# Altium schematic sheet 05 CPU_PWR.SchDoc
size 420 x 297 mm; Address1: Address1; Address2: Address2; Address3: Address3; Address4: Address4; DocumentNumber: АБВГ.123456.001 Э3; SheetNumber: 5; SheetTotal: 23; Scale: 1:1; DocumentType: Схема электрическая принципиальная; FirstReferrence: АБВГ.123456.001
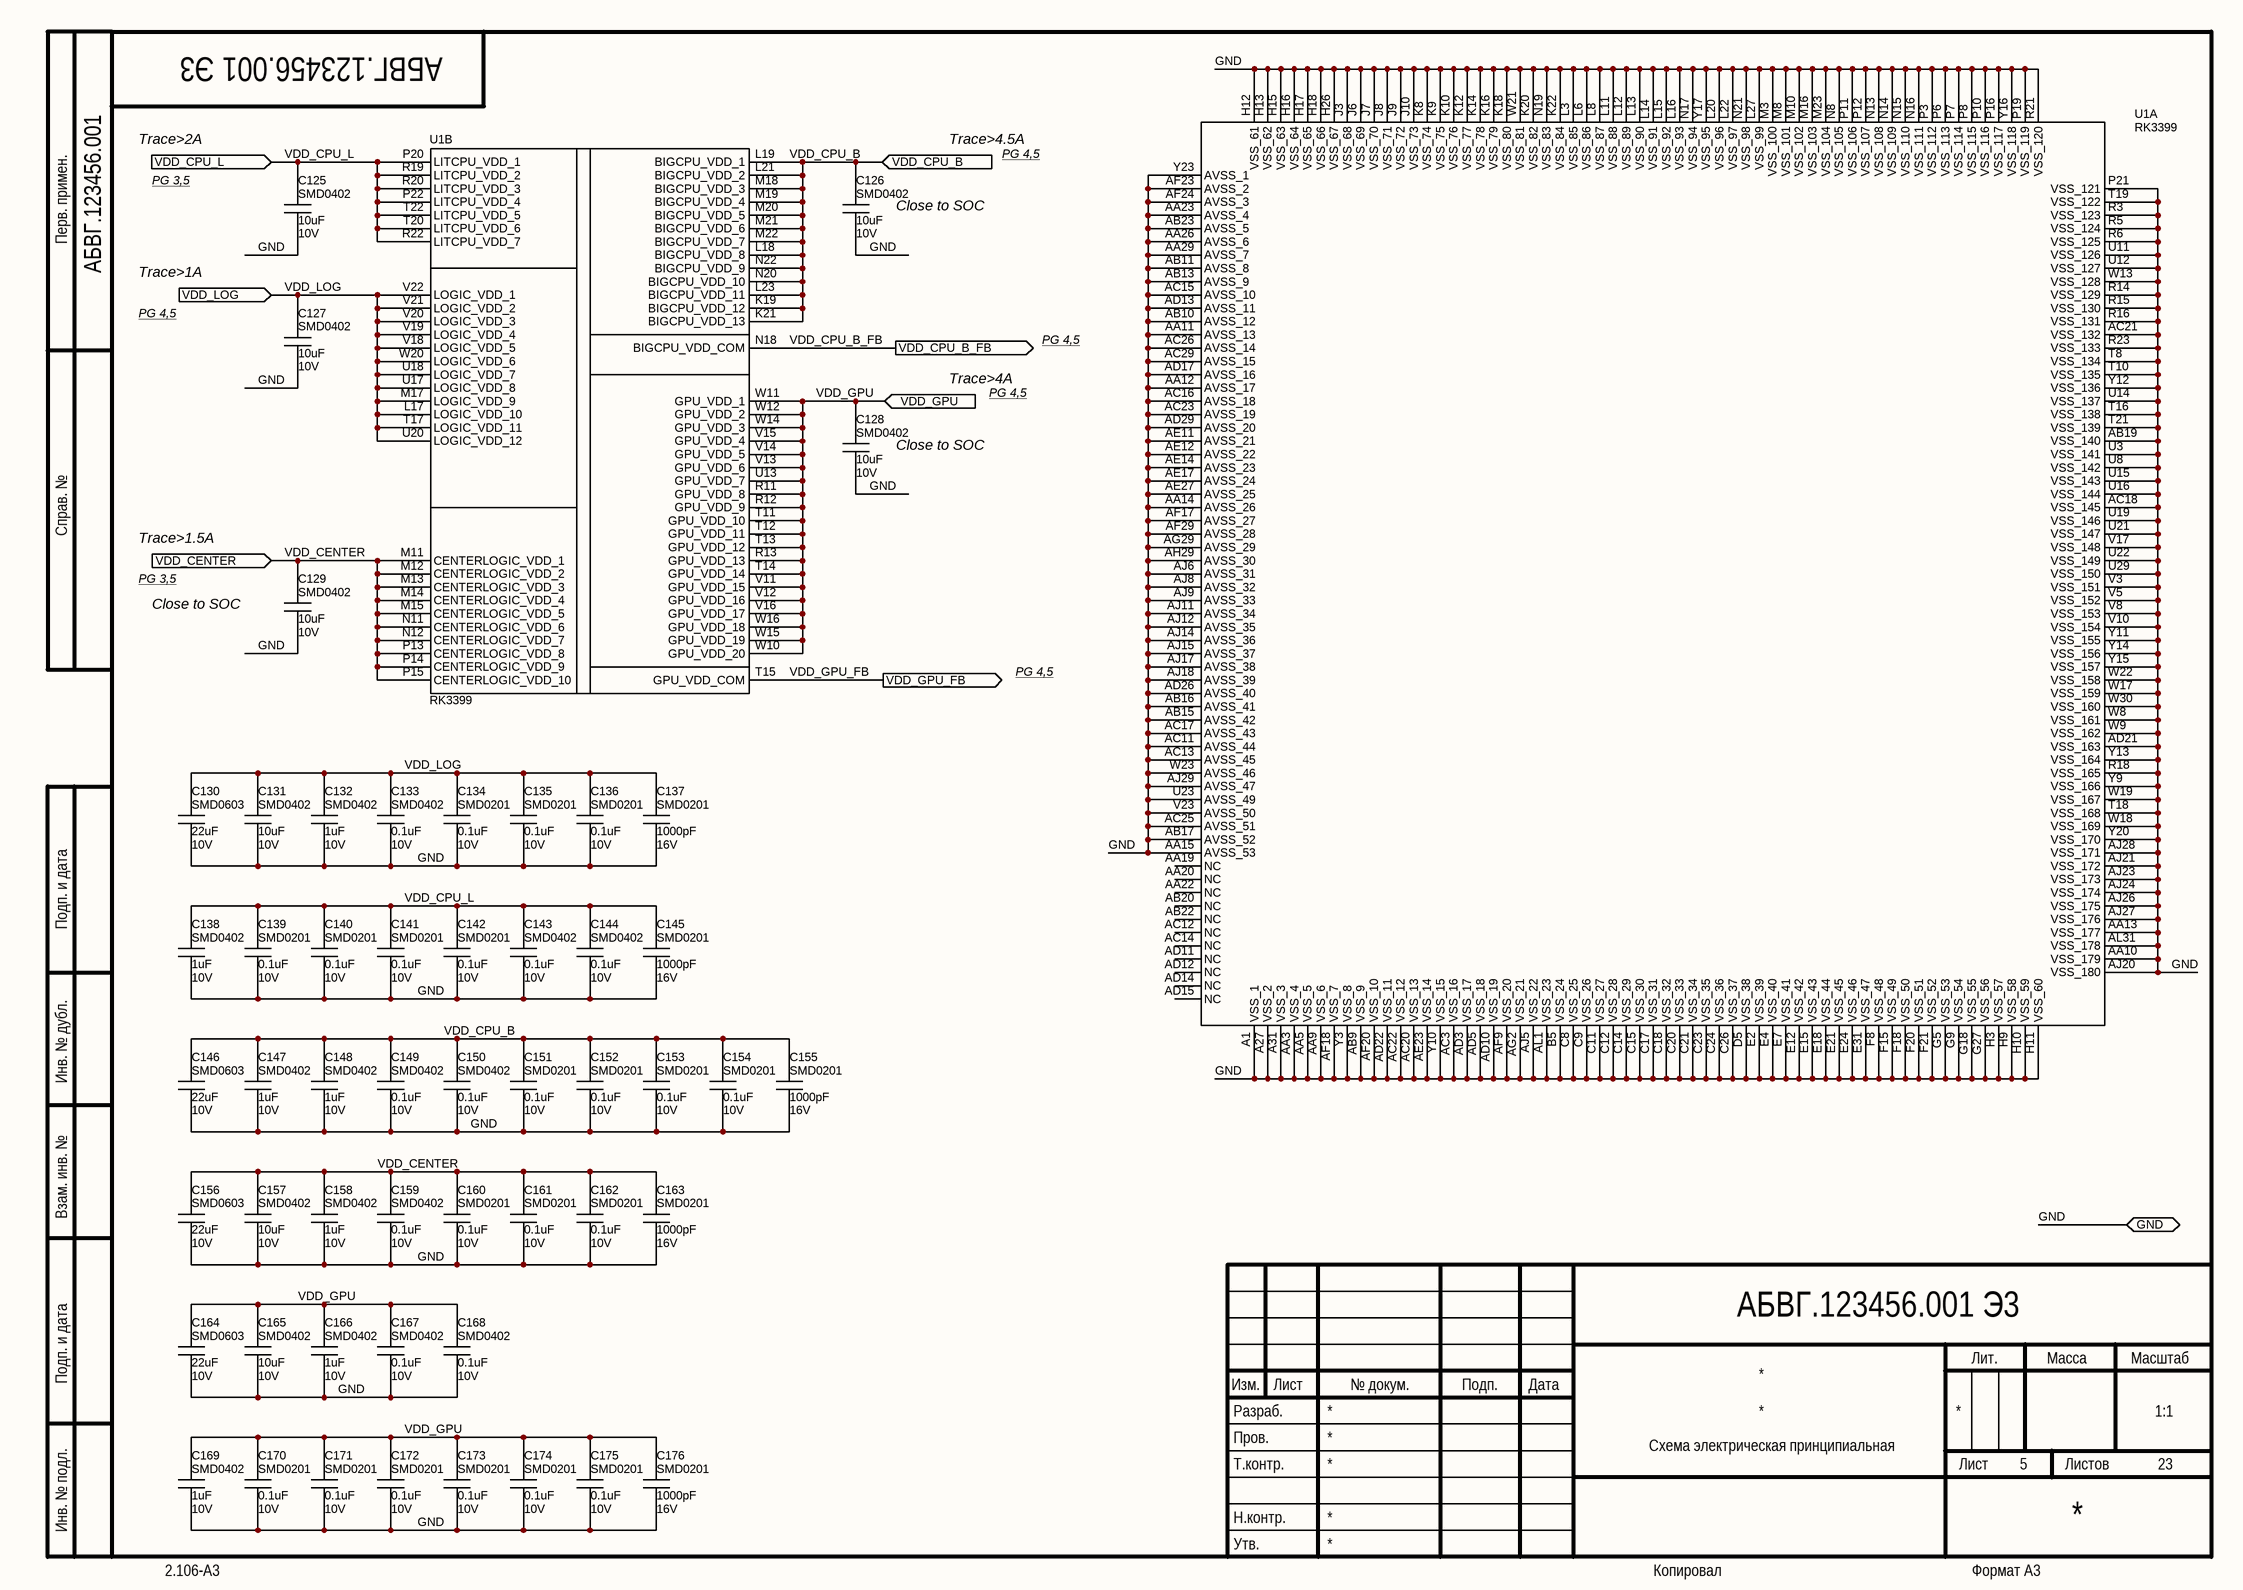
[diagram p0: 05 CPU_PWR.SchDoc]

## Parts
C125  Package: SMD0402  Voltage: 10V  [CAP_SMD_0402_small]  (hidden comment: 10uF)
C126  Package: SMD0402  Voltage: 10V  [CAP_SMD_0402]  (hidden comment: 10uF)
C127  Package: SMD0402  Voltage: 10V  [CAP_SMD_0402_small]  (hidden comment: 10uF)
C128  Package: SMD0402  Voltage: 10V  [CAP_SMD_0402_small]  (hidden comment: 10uF)
C129  Package: SMD0402  Voltage: 10V  [CAP_SMD_0402]  (hidden comment: 10uF)
C130  Package: SMD0603  Voltage: 10V  [CAP_SMD_0603]  (hidden comment: 22uF)
C131  Package: SMD0402  Voltage: 10V  [CAP_SMD_0402_small]  (hidden comment: 10uF)
C132  Package: SMD0402  Voltage: 10V  [CAP_SMD_0402]  (hidden comment: 1uF)
C133  Package: SMD0402  Voltage: 10V  [CAP_SMD_0402]  (hidden comment: 0.1uF)
C134  Package: SMD0201  Voltage: 10V  [CAP_SMD_0201]  (hidden comment: 0.1uF)
C135  Package: SMD0201  Voltage: 10V  [CAP_SMD_0201]  (hidden comment: 0.1uF)
C136  Package: SMD0201  Voltage: 10V  [CAP_SMD_0201]  (hidden comment: 0.1uF)
C137  Package: SMD0201  Voltage: 16V  [CAP_SMD_0201]  (hidden comment: 1000pF)
C138  Package: SMD0402  Voltage: 10V  [CAP_SMD_0402]  (hidden comment: 1uF)
C139  Package: SMD0201  Voltage: 10V  [CAP_SMD_0201]  (hidden comment: 0.1uF)
C140  Package: SMD0201  Voltage: 10V  [CAP_SMD_0201]  (hidden comment: 0.1uF)
C141  Package: SMD0201  Voltage: 10V  [CAP_SMD_0201]  (hidden comment: 0.1uF)
C142  Package: SMD0201  Voltage: 10V  [CAP_SMD_0201]  (hidden comment: 0.1uF)
C143  Package: SMD0402  Voltage: 10V  [CAP_SMD_0402]  (hidden comment: 0.1uF)
C144  Package: SMD0402  Voltage: 10V  [CAP_SMD_0402]  (hidden comment: 0.1uF)
C145  Package: SMD0201  Voltage: 16V  [CAP_SMD_0201]  (hidden comment: 1000pF)
C146  Package: SMD0603  Voltage: 10V  [CAP_SMD_0603]  (hidden comment: 22uF)
C147  Package: SMD0402  Voltage: 10V  [CAP_SMD_0402]  (hidden comment: 1uF)
C148  Package: SMD0402  Voltage: 10V  [CAP_SMD_0402_small]  (hidden comment: 1uF)
C149  Package: SMD0402  Voltage: 10V  [CAP_SMD_0402]  (hidden comment: 0.1uF)
C150  Package: SMD0402  Voltage: 10V  [CAP_SMD_0402]  (hidden comment: 0.1uF)
C151  Package: SMD0201  Voltage: 10V  [CAP_SMD_0201]  (hidden comment: 0.1uF)
C152  Package: SMD0201  Voltage: 10V  [CAP_SMD_0201]  (hidden comment: 0.1uF)
C153  Package: SMD0201  Voltage: 10V  [CAP_SMD_0201]  (hidden comment: 0.1uF)
C154  Package: SMD0201  Voltage: 10V  [CAP_SMD_0201]  (hidden comment: 0.1uF)
C155  Package: SMD0201  Voltage: 16V  [CAP_SMD_0201]  (hidden comment: 1000pF)
C156  Package: SMD0603  Voltage: 10V  [CAP_SMD_0603]  (hidden comment: 22uF)
C157  Package: SMD0402  Voltage: 10V  [CAP_SMD_0402_small]  (hidden comment: 10uF)
C158  Package: SMD0402  Voltage: 10V  [CAP_SMD_0402_small]  (hidden comment: 1uF)
C159  Package: SMD0402  Voltage: 10V  [CAP_SMD_0402]  (hidden comment: 0.1uF)
C160  Package: SMD0201  Voltage: 10V  [CAP_SMD_0201]  (hidden comment: 0.1uF)
C161  Package: SMD0201  Voltage: 10V  [CAP_SMD_0201]  (hidden comment: 0.1uF)
C162  Package: SMD0201  Voltage: 10V  [CAP_SMD_0201]  (hidden comment: 0.1uF)
C163  Package: SMD0201  Voltage: 16V  [CAP_SMD_0201]  (hidden comment: 1000pF)
C164  Package: SMD0603  Voltage: 10V  [CAP_SMD_0603]  (hidden comment: 22uF)
C165  Package: SMD0402  Voltage: 10V  [CAP_SMD_0402]  (hidden comment: 10uF)
C166  Package: SMD0402  Voltage: 10V  [CAP_SMD_0402]  (hidden comment: 1uF)
C167  Package: SMD0402  Voltage: 10V  [CAP_SMD_0402]  (hidden comment: 0.1uF)
C168  Package: SMD0402  Voltage: 10V  [CAP_SMD_0402]  (hidden comment: 0.1uF)
C169  Package: SMD0402  Voltage: 10V  [CAP_SMD_0402_small]  (hidden comment: 1uF)
C170  Package: SMD0201  Voltage: 10V  [CAP_SMD_0201]  (hidden comment: 0.1uF)
C171  Package: SMD0201  Voltage: 10V  [CAP_SMD_0201]  (hidden comment: 0.1uF)
C172  Package: SMD0201  Voltage: 10V  [CAP_SMD_0201]  (hidden comment: 0.1uF)
C173  Package: SMD0201  Voltage: 10V  [CAP_SMD_0201]  (hidden comment: 0.1uF)
C174  Package: SMD0201  Voltage: 10V  [CAP_SMD_0201]  (hidden comment: 0.1uF)
C175  Package: SMD0201  Voltage: 10V  [CAP_SMD_0201]  (hidden comment: 0.1uF)
C176  Package: SMD0201  Voltage: 16V  [CAP_SMD_0201]  (hidden comment: 1000pF)
U1  value RK3399  [BGA828C65P31X31_2100X2100X161N]  (hidden comment: RK3399_FF)  (parts A,B of 23)

## Ports
GND (bidir), VDD_CENTER (in), VDD_CPU_B (in), VDD_CPU_B_FB (out), VDD_CPU_L (in), VDD_GPU (in), VDD_GPU_FB (out), VDD_LOG (in)

## Nets
GND: C125.2 C126.2 C127.2 C128.2 C129.2 C130.1 C131.2 C132.2 C133.2 C134.2 C135.2 C136.2 C137.2 C138.2 C139.2 C140.2 C141.2 C142.2 C143.2 C144.2 C145.2 C146.1 C147.2 C148.2 C149.2 C150.2 C151.2 C152.2 C153.2 C154.2 C155.2 C156.1 C157.2 C158.2 C159.2 C160.2 C161.2 C162.2 C163.2 C164.1 C165.2 C166.2 C167.2 C168.2 C169.2 C170.2 C171.2 C172.2 C173.2 C174.2 C175.2 C176.2 U1.A1(VSS_1) U1.A27(VSS_2) U1.A31(VSS_3) U1.AA3(VSS_4) U1.AA5(VSS_5) U1.AA9(VSS_6) U1.AA10(VSS_179) U1.AA11(AVSS_13) U1.AA12(AVSS_17) U1.AA13(VSS_177) U1.AA14(AVSS_26) U1.AA15(AVSS_53) U1.AA23(AVSS_4) U1.AA26(AVSS_6) U1.AA29(AVSS_7) U1.AB9(VSS_9) U1.AB10(AVSS_12) U1.AB11(AVSS_8) U1.AB13(AVSS_9) U1.AB15(AVSS_42) U1.AB16(AVSS_41) U1.AB17(AVSS_52) U1.AB19(VSS_140) U1.AB23(AVSS_5) U1.AC3(VSS_16) U1.AC11(AVSS_44) U1.AC13(AVSS_45) U1.AC15(AVSS_10) U1.AC16(AVSS_18) U1.AC17(AVSS_43) U1.AC18(VSS_145) U1.AC20(VSS_13) U1.AC21(VSS_132) U1.AC22(VSS_12) U1.AC23(AVSS_19) U1.AC25(AVSS_51) U1.AC26(AVSS_14) U1.AC29(AVSS_15) U1.AD3(VSS_17) U1.AD5(VSS_18) U1.AD10(VSS_19) U1.AD13(AVSS_11) U1.AD17(AVSS_16) U1.AD21(VSS_163) U1.AD22(VSS_11) U1.AD26(AVSS_40) U1.AD29(AVSS_20) U1.AE11(AVSS_21) U1.AE12(AVSS_22) U1.AE14(AVSS_23) U1.AE17(AVSS_24) U1.AE23(VSS_14) U1.AE27(AVSS_25) U1.AF9(VSS_20) U1.AF17(AVSS_27) U1.AF18(VSS_7) U1.AF20(VSS_10) U1.AF23(AVSS_2) U1.AF24(AVSS_3) U1.AF29(AVSS_28) U1.AG2(VSS_21) U1.AG29(AVSS_29) U1.AH29(AVSS_30) U1.AJ5(VSS_22) U1.AJ6(AVSS_31) U1.AJ8(AVSS_32) U1.AJ9(AVSS_33) U1.AJ11(AVSS_34) U1.AJ12(AVSS_35) U1.AJ14(AVSS_36) U1.AJ15(AVSS_37) U1.AJ17(AVSS_38) U1.AJ18(AVSS_39) U1.AJ20(VSS_180) U1.AJ21(VSS_172) U1.AJ23(VSS_173) U1.AJ24(VSS_174) U1.AJ26(VSS_175) U1.AJ27(VSS_176) U1.AJ28(VSS_171) U1.AJ29(AVSS_47) U1.AL1(VSS_23) U1.AL31(VSS_178) U1.B5(VSS_24) U1.C8(VSS_25) U1.C9(VSS_26) U1.C11(VSS_27) U1.C12(VSS_28) U1.C14(VSS_29) U1.C15(VSS_30) U1.C17(VSS_31) U1.C18(VSS_32) U1.C20(VSS_33) U1.C21(VSS_34) U1.C23(VSS_35) U1.C24(VSS_36) U1.C26(VSS_37) U1.D5(VSS_38) U1.E2(VSS_39) U1.E4(VSS_40) U1.E7(VSS_41) U1.E12(VSS_42) U1.E15(VSS_43) U1.E18(VSS_44) U1.E21(VSS_45) U1.E24(VSS_46) U1.E31(VSS_47) U1.F8(VSS_48) U1.F15(VSS_49) U1.F18(VSS_50) U1.F20(VSS_51) U1.F21(VSS_52) U1.G5(VSS_53) U1.G9(VSS_54) U1.G18(VSS_55) U1.G27(VSS_56) U1.H3(VSS_57) U1.H9(VSS_58) U1.H10(VSS_59) U1.H11(VSS_60) U1.H12(VSS_61) U1.H13(VSS_62) U1.H15(VSS_63) U1.H16(VSS_64) U1.H17(VSS_65) U1.H18(VSS_66) U1.H26(VSS_67) U1.J3(VSS_68) U1.J6(VSS_69) U1.J7(VSS_70) U1.J8(VSS_71) U1.J9(VSS_72) U1.J10(VSS_73) U1.K8(VSS_74) U1.K9(VSS_75) U1.K10(VSS_76) U1.K12(VSS_77) U1.K14(VSS_78) U1.K16(VSS_79) U1.K18(VSS_80) U1.K20(VSS_82) U1.K22(VSS_84) U1.L3(VSS_85) U1.L6(VSS_86) U1.L8(VSS_87) U1.L11(VSS_88) U1.L12(VSS_89) U1.L13(VSS_90) U1.L14(VSS_91) U1.L15(VSS_92) U1.L16(VSS_93) U1.L20(VSS_96) U1.L22(VSS_97) U1.L27(VSS_99) U1.M3(VSS_100) U1.M8(VSS_101) U1.M10(VSS_102) U1.M16(VSS_103) U1.M23(VSS_104) U1.N8(VSS_105) U1.N13(VSS_108) U1.N14(VSS_109) U1.N15(VSS_110) U1.N16(VSS_111) U1.N17(VSS_94) U1.N19(VSS_83) U1.N21(VSS_98) U1.P3(VSS_112) U1.P6(VSS_113) U1.P7(VSS_114) U1.P8(VSS_115) U1.P10(VSS_116) U1.P11(VSS_106) U1.P12(VSS_107) U1.P16(VSS_117) U1.P19(VSS_119) U1.P21(VSS_121) U1.R3(VSS_123) U1.R5(VSS_124) U1.R6(VSS_125) U1.R14(VSS_129) U1.R15(VSS_130) U1.R16(VSS_131) U1.R18(VSS_165) U1.R21(VSS_120) U1.R23(VSS_133) U1.T8(VSS_134) U1.T10(VSS_135) U1.T16(VSS_138) U1.T18(VSS_168) U1.T19(VSS_122) U1.T21(VSS_139) U1.U3(VSS_141) U1.U8(VSS_142) U1.U11(VSS_126) U1.U12(VSS_127) U1.U14(VSS_137) U1.U15(VSS_143) U1.U16(VSS_144) U1.U19(VSS_146) U1.U21(VSS_147) U1.U22(VSS_149) U1.U23(AVSS_49) U1.U29(VSS_150) U1.V3(VSS_151) U1.V5(VSS_152) U1.V8(VSS_153) U1.V10(VSS_154) U1.V17(VSS_148) U1.V23(AVSS_50) U1.W8(VSS_161) U1.W9(VSS_162) U1.W13(VSS_128) U1.W17(VSS_159) U1.W18(VSS_169) U1.W19(VSS_167) U1.W21(VSS_81) U1.W22(VSS_158) U1.W23(AVSS_46) U1.W30(VSS_160) U1.Y3(VSS_8) U1.Y9(VSS_166) U1.Y10(VSS_15) U1.Y11(VSS_155) U1.Y12(VSS_136) U1.Y13(VSS_164) U1.Y14(VSS_156) U1.Y15(VSS_157) U1.Y16(VSS_118) U1.Y17(VSS_95) U1.Y20(VSS_170) U1.Y23(AVSS_1) ; port GND
VDD_CENTER: C129.1 C156.2 C157.1 C158.1 C159.1 C160.1 C161.1 C162.1 C163.1 U1.M11(CENTERLOGIC_VDD_1) U1.M12(CENTERLOGIC_VDD_2) U1.M13(CENTERLOGIC_VDD_3) U1.M14(CENTERLOGIC_VDD_4) U1.M15(CENTERLOGIC_VDD_5) U1.N11(CENTERLOGIC_VDD_6) U1.N12(CENTERLOGIC_VDD_7) U1.P13(CENTERLOGIC_VDD_8) U1.P14(CENTERLOGIC_VDD_9) U1.P15(CENTERLOGIC_VDD_10) ; port VDD_CENTER
VDD_CPU_B: C126.1 C146.2 C147.1 C148.1 C149.1 C150.1 C151.1 C152.1 C153.1 C154.1 C155.1 U1.K19(BIGCPU_VDD_12) U1.K21(BIGCPU_VDD_13) U1.L18(BIGCPU_VDD_8) U1.L19(BIGCPU_VDD_1) U1.L21(BIGCPU_VDD_2) U1.L23(BIGCPU_VDD_11) U1.M18(BIGCPU_VDD_3) U1.M19(BIGCPU_VDD_4) U1.M20(BIGCPU_VDD_5) U1.M21(BIGCPU_VDD_6) U1.M22(BIGCPU_VDD_7) U1.N20(BIGCPU_VDD_10) U1.N22(BIGCPU_VDD_9) ; port VDD_CPU_B
VDD_CPU_B_FB: U1.N18(BIGCPU_VDD_COM) ; port VDD_CPU_B_FB
VDD_CPU_L: C125.1 C138.1 C139.1 C140.1 C141.1 C142.1 C143.1 C144.1 C145.1 U1.P20(LITCPU_VDD_1) U1.P22(LITCPU_VDD_4) U1.R19(LITCPU_VDD_2) U1.R20(LITCPU_VDD_3) U1.R22(LITCPU_VDD_7) U1.T20(LITCPU_VDD_6) U1.T22(LITCPU_VDD_5) ; port VDD_CPU_L
VDD_GPU: C128.1 C164.2 C165.1 C166.1 C167.1 C168.1 C169.1 C170.1 C171.1 C172.1 C173.1 C174.1 C175.1 C176.1 U1.R11(GPU_VDD_8) U1.R12(GPU_VDD_9) U1.R13(GPU_VDD_13) U1.T11(GPU_VDD_10) U1.T12(GPU_VDD_11) U1.T13(GPU_VDD_12) U1.T14(GPU_VDD_14) U1.U13(GPU_VDD_7) U1.V11(GPU_VDD_15) U1.V12(GPU_VDD_16) U1.V13(GPU_VDD_6) U1.V14(GPU_VDD_5) U1.V15(GPU_VDD_4) U1.V16(GPU_VDD_17) U1.W10(GPU_VDD_20) U1.W11(GPU_VDD_1) U1.W12(GPU_VDD_2) U1.W14(GPU_VDD_3) U1.W15(GPU_VDD_19) U1.W16(GPU_VDD_18) ; port VDD_GPU
VDD_GPU_FB: U1.T15(GPU_VDD_COM) ; port VDD_GPU_FB
VDD_LOG: C127.1 C130.2 C131.1 C132.1 C133.1 C134.1 C135.1 C136.1 C137.1 U1.L17(LOGIC_VDD_10) U1.M17(LOGIC_VDD_9) U1.T17(LOGIC_VDD_11) U1.U17(LOGIC_VDD_8) U1.U18(LOGIC_VDD_7) U1.U20(LOGIC_VDD_12) U1.V18(LOGIC_VDD_5) U1.V19(LOGIC_VDD_4) U1.V20(LOGIC_VDD_3) U1.V21(LOGIC_VDD_2) U1.V22(LOGIC_VDD_1) U1.W20(LOGIC_VDD_6) ; port VDD_LOG

Not connected (* = marked no-connect by the designer): U1 AA19(NC) AA20(NC) AA22(NC) AB20(NC) AB22(NC) AC12(NC) AC14(NC) AD11(NC) AD12(NC) AD14(NC) AD15(NC)

## Notes on the sheet
- Trace>2A
- PG 3,5
- Trace>4.5A
- PG 4,5
- Перв. примен.
- (near C126) Close to SOC
- Trace>1A
- Trace>4A
- (near C128) Close to SOC
- Справ. №
- Trace>1.5A
- Close to SOC
- Подп. и дата
- Инв. № дубл.
- Взам. инв. №
- Разраб.
- Изм.
- Лист
- № докум.
- Подп.
- Дата
- Лит.
- Масса
- Масштаб
- Пров.
- Т.контр.
- Листов
- Инв. № подл.
- Утв.
- Н.контр.
- 2.106-A3
- Копировал
- Формат А3

## Library data of the parts
C125-C129 C131 C157 C165 = Ceramic_Cap: PartNumber: CC0402MRX5R6BB106; ComponentType: SMD Ceramic Chip Capacitor; Manufacter: *; Tolerance: *; Value: 10uF
  C125 C127 C128 C131 C157: ClassName: Solder_Clearence
  C126 C129 C165: ClassName: *
C130 C146 C156 C164 = Ceramic_Cap: PartNumber: CL10A226MP8NUNE; ComponentType: SMD Ceramic Chip Capacitor; Manufacter: *; Tolerance: *; ClassName: *; Value: 22uF
C132 C138 C147 C148 C158 C166 C169 = Ceramic_Cap: PartNumber: CC0402KRX5R6BB105; ComponentType: SMD Ceramic Chip Capacitor; Manufacter: *; Tolerance: *; Value: 1uF
  C132 C138 C147 C166: ClassName: *
  C148 C158 C169: ClassName: Solder_Clearence
C133 C143 C144 C149 C150 C159 C167 C168 = Ceramic_Cap: PartNumber: CC0402KRX5R6BB104; ComponentType: SMD Ceramic Chip Capacitor; Manufacter: *; Tolerance: *; ClassName: *; Value: 0.1uF
C134-C136 C139-C142 C151-C154 C160-C162 C170-C175 = Ceramic_Cap: PartNumber: CC0201KRX5R6BB104; ComponentType: SMD Ceramic Chip Capacitor; Manufacter: *; Tolerance: *; ClassName: *; Value: 0.1uF
C137 C145 C155 C163 C176 = Ceramic_Cap: PartNumber: CC0201KRX7R7BB102; ComponentType: SMD Ceramic Chip Capacitor; Manufacter: *; Tolerance: *; ClassName: *; Value: 1000pF
U1 = RK3399_FF: Package: BGA828; ComponentType: *; Manufacter: *; PartNumber: RK3399; ClassName: *